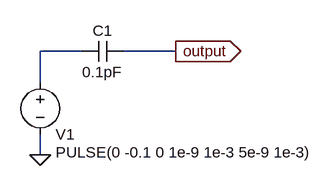
[diagram p0: schematic pulser-0.01picocoulombs.asc]
pulser-0.01picocoulombs.asc, the LTspice schematic file:
Version 4
SHEET 1 1164 944
WIRE -624 -64 -688 -64
WIRE -480 -64 -560 -64
WIRE -688 -16 -688 -64
WIRE -688 96 -688 64
FLAG -688 96 0
FLAG -480 -64 output
IOPIN -480 -64 Out
SYMBOL voltage -688 -32 R0
WINDOW 0 24 96 Left 2
WINDOW 3 24 124 Left 2
WINDOW 123 0 0 Left 2
WINDOW 39 24 152 Left 2
SYMATTR InstName V1
SYMATTR Value PULSE(0 -0.1 0 1e-9 1e-3 5e-9 1e-3)
SYMBOL cap -560 -80 R90
WINDOW 0 0 32 VBottom 2
WINDOW 3 32 32 VTop 2
SYMATTR InstName C1
SYMATTR Value 0.1pF

The netlist it stands for:
* pulser-0.01picocoulombs.asc
V1 N001 0 PULSE(0 -0.1 0 1e-9 1e-3 5e-9 1e-3)
C1 output N001 0.1pF
.backanno
.end